# Altium project QUTMS_MCISO-V01.PrjPcb
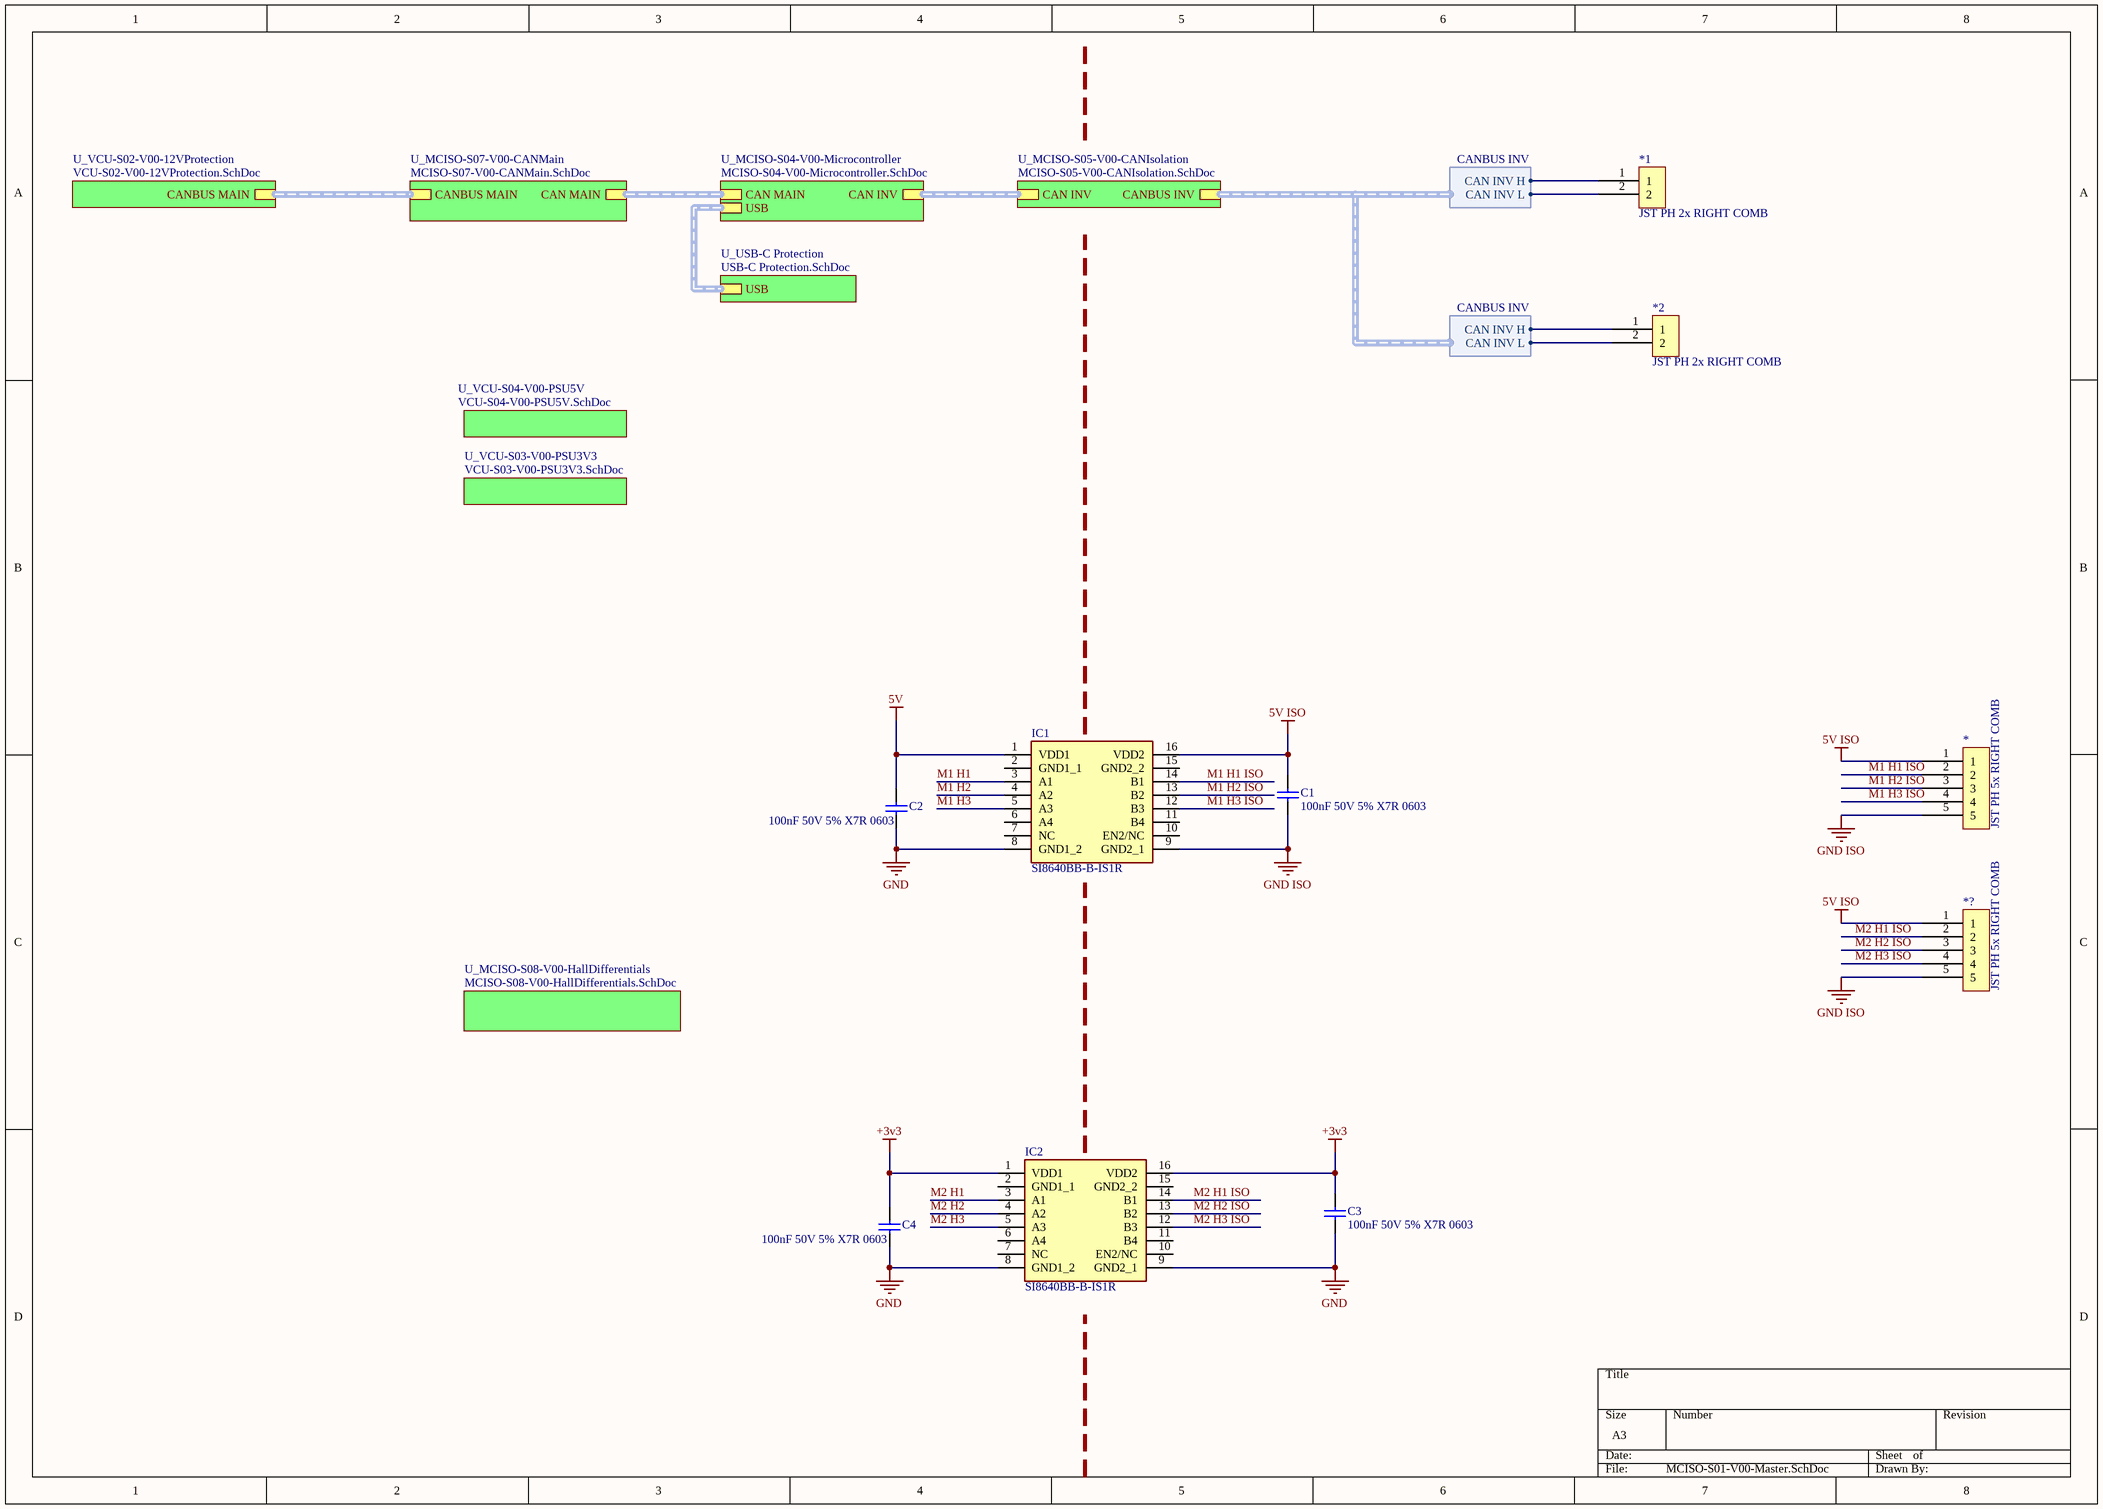
[diagram p0: MCISO-S01-V00-Master.SchDoc]
9 sheets, 120 parts. Net scope: hierarchical (ports join the sheet entries above them; power ports are global).
Board file: MCISO-P01-V00.PcbDoc
Sheets:
  MCISO-S01-V00-Master.SchDoc
    U_MCISO-S05-V00-CANIsolation = MCISO-S05-V00-CANIsolation.SchDoc
    U_MCISO-S04-V00-Microcontroller = MCISO-S04-V00-Microcontroller.SchDoc
    U_MCISO-S07-V00-CANMain = MCISO-S07-V00-CANMain.SchDoc
    U_VCU-S02-V00-12VProtection = VCU-S02-V00-12VProtection.SchDoc
    U_VCU-S03-V00-PSU3V3 = VCU-S03-V00-PSU3V3.SchDoc
    U_VCU-S04-V00-PSU5V = VCU-S04-V00-PSU5V.SchDoc
    U_MCISO-S08-V00-HallDifferentials = MCISO-S08-V00-HallDifferentials.SchDoc
    U_USB-C Protection = USB-C Protection.SchDoc

## Sheet MCISO-S01-V00-Master.SchDoc
size A3; SheetNumber: 1; SheetTotal: 9

### Parts
(Parts that share a designator on the sheet are numbered #1, #2 ... from top to bottom, then left to right.)
*1  JST PH 2x RIGHT COMB  [JST PH 2x RIGHT COMB]
*2  JST PH 2x RIGHT COMB  [JST PH 2x RIGHT COMB]
*#1  JST PH 5x RIGHT COMB  [JST PH 5x RIGHT COMB]
*?#1  JST PH 5x RIGHT COMB  [JST PH 5x RIGHT COMB]
C1  100nF 50V 5% X7R 0603  [Cap_Ceramic_0603]
C2  100nF 50V 5% X7R 0603  [Cap_Ceramic_0603]
C3  100nF 50V 5% X7R 0603  [Cap_Ceramic_0603]
C4  100nF 50V 5% X7R 0603  [Cap_Ceramic_0603]
IC1  SI8640BB-B-IS1R  [SOIC127P600X175-16N]
IC2  SI8640BB-B-IS1R  [SOIC127P600X175-16N]

### Sub-sheets
U_MCISO-S04-V00-Microcontroller = MCISO-S04-V00-Microcontroller.SchDoc: CAN MAIN (harness CAN MAIN), CAN INV (harness CAN INV), USB (harness *)
U_MCISO-S05-V00-CANIsolation = MCISO-S05-V00-CANIsolation.SchDoc: CAN INV (harness CAN), CANBUS INV (harness CANBUS INV)
U_MCISO-S07-V00-CANMain = MCISO-S07-V00-CANMain.SchDoc: CAN MAIN (harness CAN2), CANBUS MAIN (harness CANBUS2)
U_MCISO-S08-V00-HallDifferentials = MCISO-S08-V00-HallDifferentials.SchDoc: no entries
U_USB-C Protection = USB-C Protection.SchDoc: USB (harness *)
U_VCU-S02-V00-12VProtection = VCU-S02-V00-12VProtection.SchDoc: CANBUS MAIN (harness CANBUS MAIN)
U_VCU-S03-V00-PSU3V3 = VCU-S03-V00-PSU3V3.SchDoc: no entries
U_VCU-S04-V00-PSU5V = VCU-S04-V00-PSU5V.SchDoc: no entries

### Harnesses
CANBUS INV: CAN INV H, CAN INV L

### Nets
5V: C2.2 IC1.1(VDD1)
5V ISO: *#1.1 *?#1.1 C1.2 IC1.16(VDD2)
+3v3: C3.2 C4.2 IC2.1(VDD1) IC2.16(VDD2)
GND: C2.1 C3.1 C4.1 IC1.8(GND1_2) IC2.8(GND1_2) IC2.9(GND2_1)
GND ISO: *#1.5 *?#1.5 C1.1 IC1.9(GND2_1)
CAN H: *1.1 *2.1 ; sheet U_MCISO-S05-V00-CANIsolation/CANBUS INV.CAN INV H
CAN L: *1.2 *2.2 ; sheet U_MCISO-S05-V00-CANIsolation/CANBUS INV.CAN INV L
M1 H1: IC1.3(A1)
M1 H1 ISO: *#1.2 IC1.14(B1)
M1 H2: IC1.4(A2)
M1 H2 ISO: *#1.3 IC1.13(B2)
M1 H3: IC1.5(A3)
M1 H3 ISO: *#1.4 IC1.12(B3)
M2 H1: IC2.3(A1)
M2 H1 ISO: *?#1.2 IC2.14(B1)
M2 H2: IC2.4(A2)
M2 H2 ISO: *?#1.3 IC2.13(B2)
M2 H3: IC2.5(A3)
M2 H3 ISO: *?#1.4 IC2.12(B3)

Not connected (* = marked no-connect by the designer): IC1 2(GND1_1) 6(A4) 7(NC) 10(EN2/NC) 11(B4) 15(GND2_2); IC2 2(GND1_1) 6(A4) 7(NC) 10(EN2/NC) 11(B4) 15(GND2_2)

### Buses and harness runs
harness sheet U_MCISO-S04-V00-Microcontroller/CAN INV = sheet U_MCISO-S05-V00-CANIsolation/CAN INV
harness sheet U_MCISO-S04-V00-Microcontroller/CAN MAIN = sheet U_MCISO-S07-V00-CANMain/CAN MAIN
harness sheet U_MCISO-S04-V00-Microcontroller/USB = sheet U_USB-C Protection/USB
harness sheet U_MCISO-S07-V00-CANMain/CANBUS MAIN = sheet U_VCU-S02-V00-12VProtection/CANBUS MAIN

### Library data of the parts
C1-C4 = 100nF 50V 5% X7R 0603: Capacitor, Ceramic, SMD, 100nF, 50V, 5%, X7R, 0603
IC1 IC2 = SI8640BB-B-IS1R: Integrated Circuit; Manufacturer_Name: Silicon Labs; Datasheet Link: https://www.arrow.com/en/products/si8640bb-b-is1r/silicon-labs; Height: 1.75mm; Manufacturer_Part_Number: SI8640BB-B-IS1R; Mouser Part Number: 634-SI8640BB-B-IS1R; Mouser Price/Stock: https://www.mouser.co.uk/ProductDetail/Silicon-Labs/SI8640BB-B-IS1R?qs=j6MGy4L9yX09sv%252BEYaun9w%3D%3D; Arrow Part Number: SI8640BB-B-IS1R; Arrow Price/Stock: https://www.arrow.com/en/products/si8640bb-b-is1r/silicon-labs

## Sheet MCISO-S05-V00-CANIsolation.SchDoc: Isolated CANBUS @ 3V3
size A3; DrawnBy: Jonn Dillon; DocumentNumber: 4; Revision: 01; SheetNumber: 3; SheetTotal: 9; Version: 01; Project: Battery Managment System 2020; PageSetup: Record=PageOptions|CenterHorizontal=True|CenterVertical=True|PrintScale=0.97|XCorrection=1.00|YCorrection=1.00|PrintKind=0|BorderSize=5000000|LeftOffset=0|BottomOffset=0|Orientation=2|PaperLength=1000|PaperWidth=1000|Scale=100|PaperSource=7|PrintQuality=-4|MediaType=1|DitherType=10|PaperKind=A4|PrintScaleMode=1
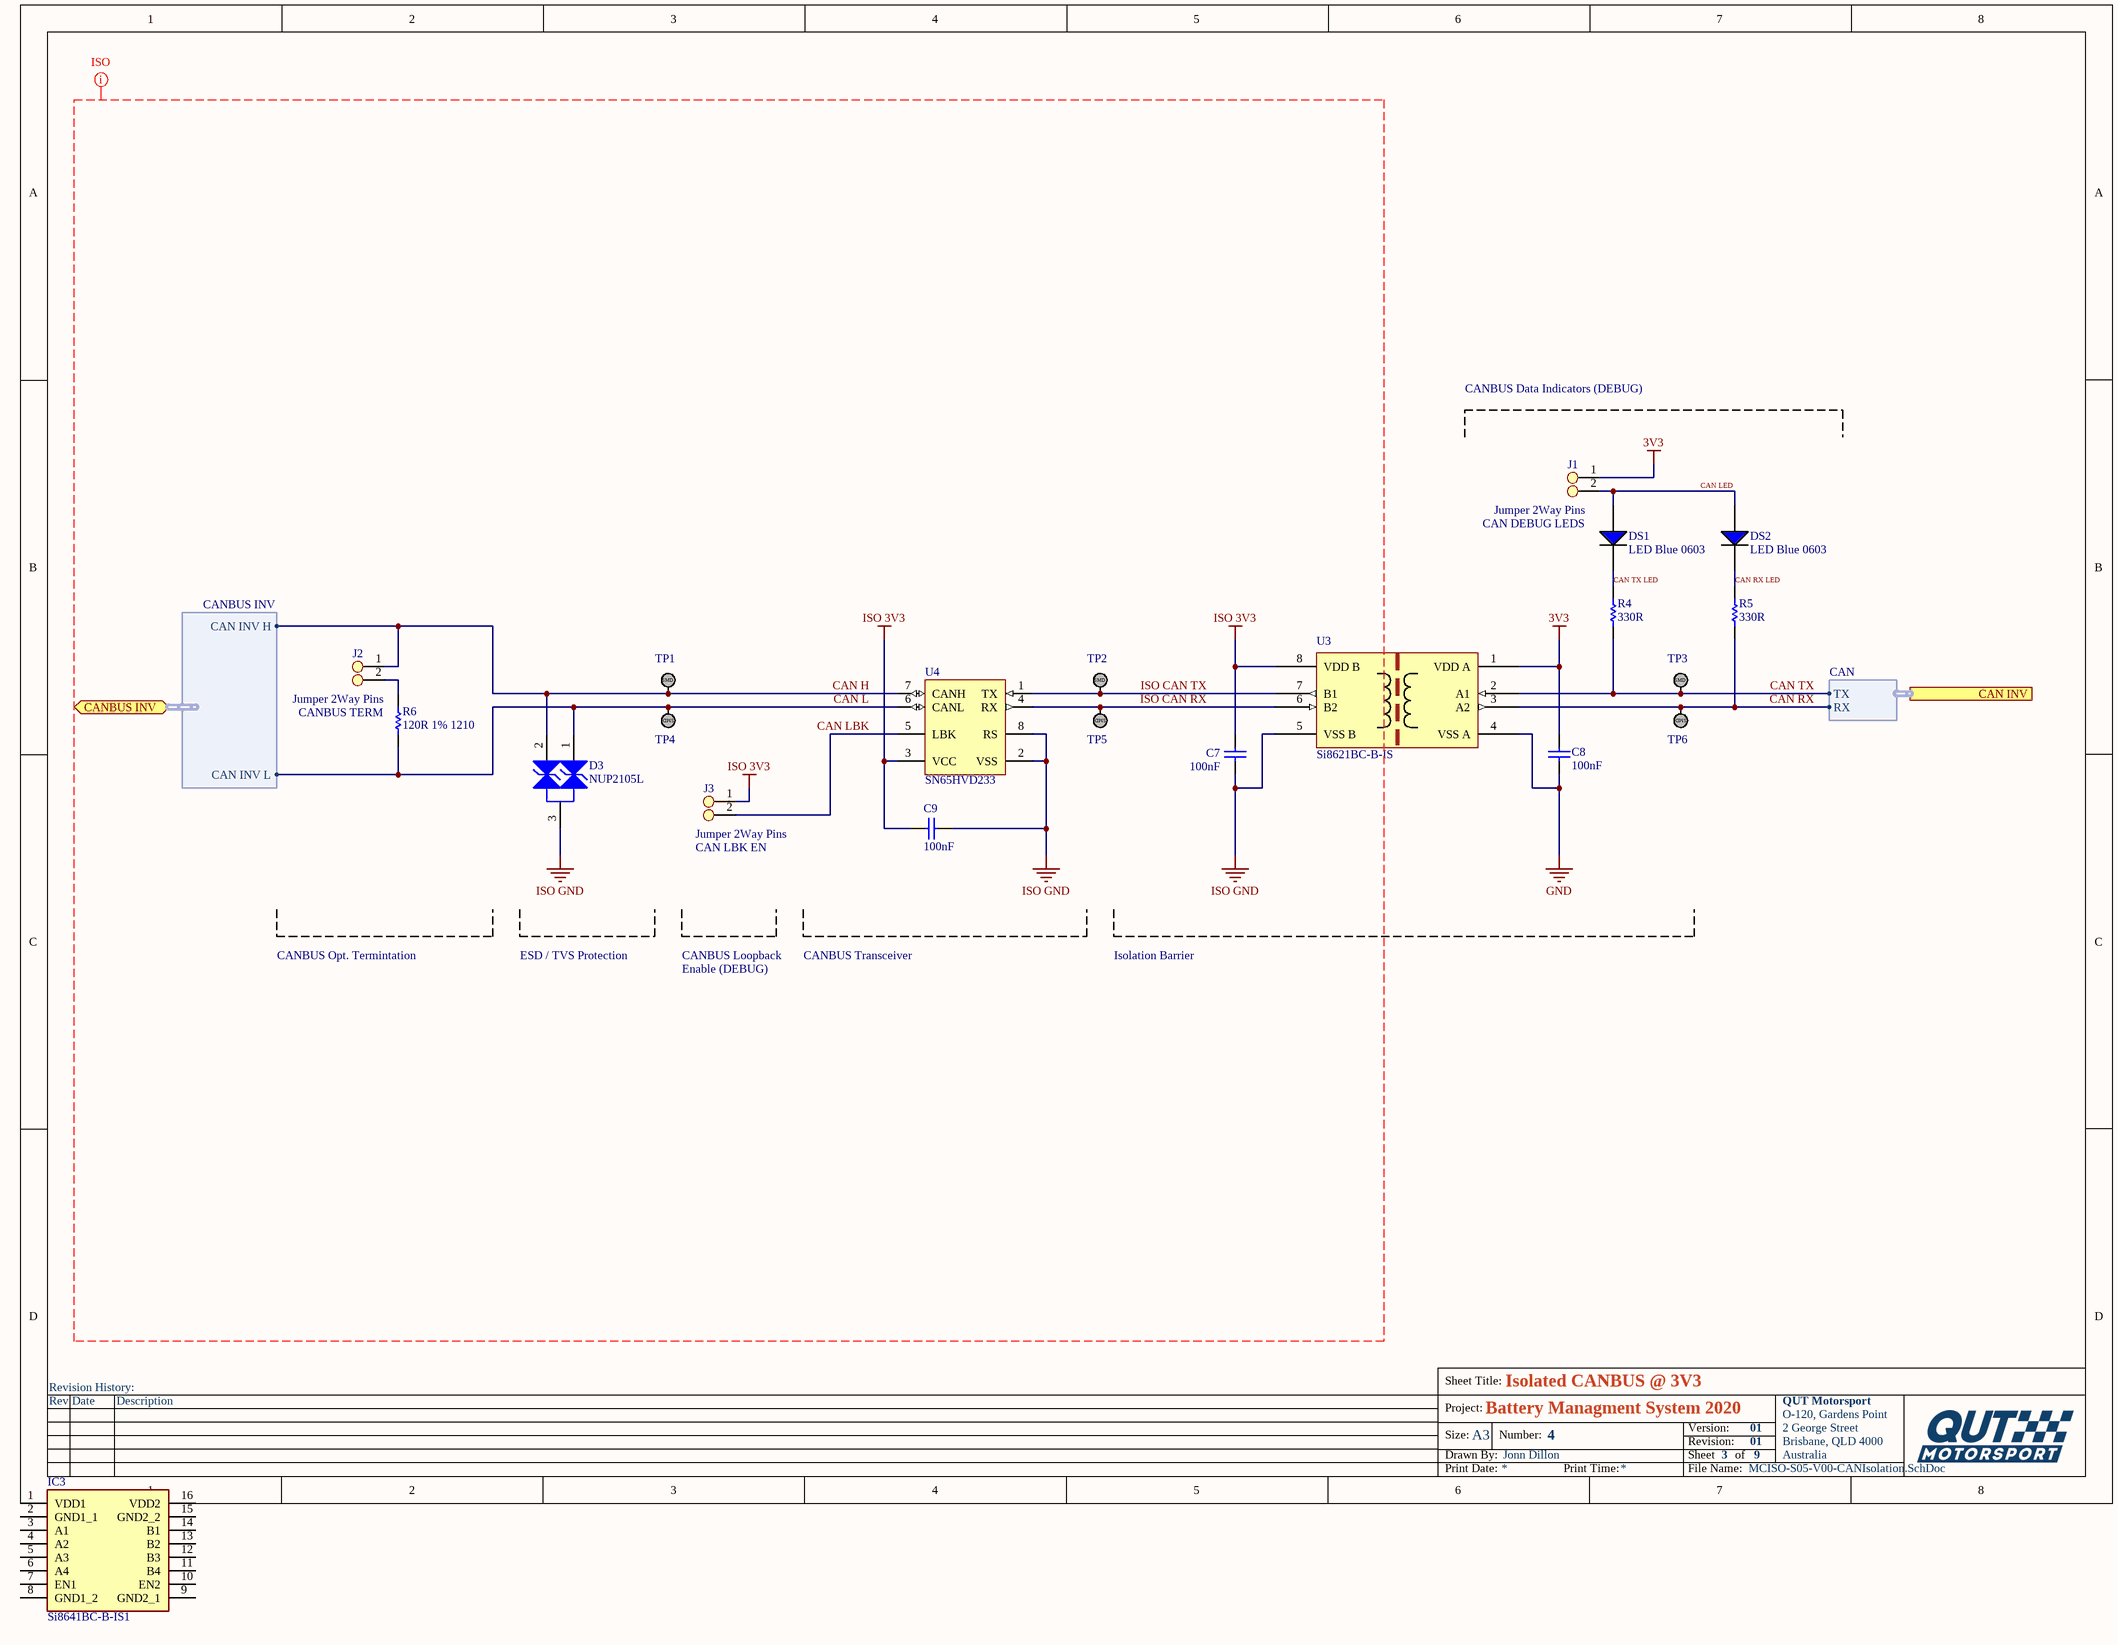
[diagram p1: MCISO-S05-V00-CANIsolation.SchDoc]

### Parts
C7  100nF  [Cap_Ceramic_0603]
C8  100nF  [Cap_Ceramic_0603]
C9  100nF  [Cap_Ceramic_0603]
D3  NUP2105L  [NUP2105L]
DS1  LED Blue 0603  [LED BLUE 0603]
DS2  LED Blue 0603  [LED BLUE 0603]
IC3  Si8641BC-B-IS1  [SOIC127P600X175-16N]
J1  Jumper 2Way Pins  [Jumper_2Way_Pin]
J2  Jumper 2Way Pins  [Jumper_2Way_Pin]
J3  Jumper 2Way Pins  [Jumper_2Way_Pin]
R4  330R  [Res_ThinFilm_0603]
R5  330R  [Res_ThinFilm_0603]
R6  120R 1% 1210  [Res_ThinFilm_1210]
TP1  TestPoint_SMD  [TestPointSMD]  (value not drawn)
TP2  TestPoint_SMD  [TestPointSMD]  (value not drawn)
TP3  TestPoint_SMD  [TestPointSMD]  (value not drawn)
TP4  TestPoint_SMD  [TestPointSMD]  (value not drawn)
TP5  TestPoint_SMD  [TestPointSMD]  (value not drawn)
TP6  TestPoint_SMD  [TestPointSMD]  (value not drawn)
U3  Si8621BC-B-IS  [Si8621BC-B-IS]
U4  SN65HVD233  [SN65HVD233DR]

### Ports
CAN INV (harness CAN), CANBUS INV (bidir, harness CANBUS INV)

### Harnesses
CANBUS INV: CAN INV H, CAN INV L
CAN: RX, TX

### Nets
3V3: C8.2 J1.1 U3.1(VDD_A)
GND: C8.1 U3.4(VSS_A)
ISO 3V3: C7.2 C9.2 J3.1 U3.8(VDD_B) U4.3(VCC)
ISO GND: C7.1 C9.1 D3.3 U3.5(VSS_B) U4.2(VSS) U4.8(RS)
CAN H: D3.2 J2.1 TP1.1 U4.7(CANH) ; port CANBUS INV.CAN INV H
CAN L: D3.1 R6.1 TP4.1 U4.6(CANL) ; port CANBUS INV.CAN INV L
CAN LBK: J3.2 U4.5(LBK)
CAN LED: DS1.1(A) DS2.1(A) J1.2
CAN RX: R5.1 TP6.1 U3.3(A2) ; port CAN INV.RX
CAN RX LED: DS2.2(C) R5.2
CAN TX: R4.1 TP3.1 U3.2(A1) ; port CAN INV.TX
CAN TX LED: DS1.2(C) R4.2
ISO CAN RX: TP5.1 U3.6(B2) U4.4(RX)
ISO CAN TX: TP2.1 U3.7(B1) U4.1(TX)
NetJ2_2: J2.2 R6.2

Not connected (* = marked no-connect by the designer): IC3 1(VDD1) 2(GND1_1) 3(A1) 4(A2) 5(A3) 6(A4) 7(EN1) 8(GND1_2) 9(GND2_1) 10(EN2) 11(B4) 12(B3) 13(B2) 14(B1) 15(GND2_2) 16(VDD2)

### Layout directives
mark named ISO: CAN H, CAN L, CAN LBK, ISO 3V3, ISO CAN RX, ISO CAN TX, ISO GND

### Notes on the sheet
- CANBUS Data Indicators (DEBUG)
- CAN DEBUG LEDS
- (near R6) CANBUS TERM
- (near J3) CAN LBK EN
- CANBUS Opt. Termintation
- ESD / TVS Protection
- CANBUS Loopback
- Enable (DEBUG)
- CANBUS Transceiver
- Isolation Barrier
- Revision History:
- Sheet Title:
- Rev
- Date
- Description
- Project:
- Size:
- Drawn By:
- A3
- Number:
- Revision:
- Sheet
- Version:
- of
- QUT Motorsport
- O-120, Gardens Point
- 2 George Street
- Brisbane, QLD 4000
- Australia
- Print Date:
- Print Time:
- File Name:
- (in symbol TestPoint_SMD) SMD

### Library data of the parts
C7-C9 = 100nF 50V 5% X7R 0603: as C1 on sheet MCISO-S01-V00-Master
IC3 = Si8641BC-B-IS1: Integrated Circuit; Manufacturer_Name: Silicon Labs; Datasheet Link: https://componentsearchengine.com/Datasheets/2/SI8641BC-B-IS1.pdf; Height: 1.75mm; Manufacturer_Part_Number: Si8641BC-B-IS1; Mouser Part Number: 634-SI8641BC-B-IS1; Mouser Price/Stock: https://www.mouser.co.uk/ProductDetail/Silicon-Labs/SI8641BC-B-IS1?qs=j6MGy4L9yX1Vde%2FgWgVbaA%3D%3D; Arrow Part Number: SI8641BC-B-IS1; Arrow Price/Stock: https://www.arrow.com/en/products/si8641bc-b-is1/silicon-labs
J1-J3 = Jumper 2Way Side Pins
R4 R5 = 330R 5% 0603: Resistor, SMD, 330R, 0.1W, 5%, 0603
R6 = 120R 1% 1210: Resistor, SMD, 120R, 0.25W, 1%, 1210
D3 = NUP2105L: ComponentLink1Description: Datasheet; ComponentLink1URL: https://www.onsemi.cn/PowerSolutions/document/NUP2105L-D.PDF; Parameter 1: *; ComponentLink2Description: LCSC; ComponentLink2URL: https://lcsc.com/product-detail/TVS_ON-Semiconductor-NUP2105LT1G_C14486.html; ComponentLink3Description: Digikey; ComponentLink3URL: https://www.digikey.com.au/product-detail/en/on-semiconductor/SZNUP2105LT1G/SZNUP2105LT1GOSCT-ND/3487669
U3 = Si8621BC-B-IS: ComponentLink1Description: Digikey; ComponentLink1URL: https://www.digikey.com.au/product-detail/en/silicon-labs/SI8621BC-B-ISR/336-4774-1-ND/8611005; ComponentLink2Description: Datasheet; ComponentLink2URL: https://www.silabs.com/documents/public/data-sheets/si861x-2x-datasheet.pdf
U4 = SN65HVD233: ComponentLink1Description: LCSC; ComponentLink1URL: https://lcsc.com/product-detail/CAN-ICs_Texas-Instruments_SN65HVD233DRG4_Texas-Instruments-Texas-Instruments-SN65HVD233DRG4_C61643.html; ComponentLink2Description: Digikey; ComponentLink2URL: https://www.digikey.com.au/product-detail/en/texas-instruments/SN65HVD233DR/296-35967-1-ND/4134960; ComponentLink3Description: Datasheet; ComponentLink3URL: https://www.ti.com/lit/ds/symlink/sn65hvd233.pdf?ts=1588560888178; ComponentLink4Description: Ti Product Page; ComponentLink4URL: https://www.ti.com/product/SN65HVD233

## Sheet MCISO-S04-V00-Microcontroller.SchDoc: AMU Microcontroller
size A3; DrawnBy: Thomas Benedetti; DocumentNumber: 4; Revision: 01; SheetNumber: 2; SheetTotal: 9; Version: 01; Project: AMU 2020; PageSetup: Record=PageOptions|CenterHorizontal=True|CenterVertical=True|PrintScale=0.97|XCorrection=1.00|YCorrection=1.00|PrintKind=0|BorderSize=5000000|LeftOffset=0|BottomOffset=0|Orientation=2|PaperLength=1000|PaperWidth=1000|Scale=100|PaperSource=7|PrintQuality=-4|MediaType=1|DitherType=10|PaperKind=A4|PrintScaleMode=1
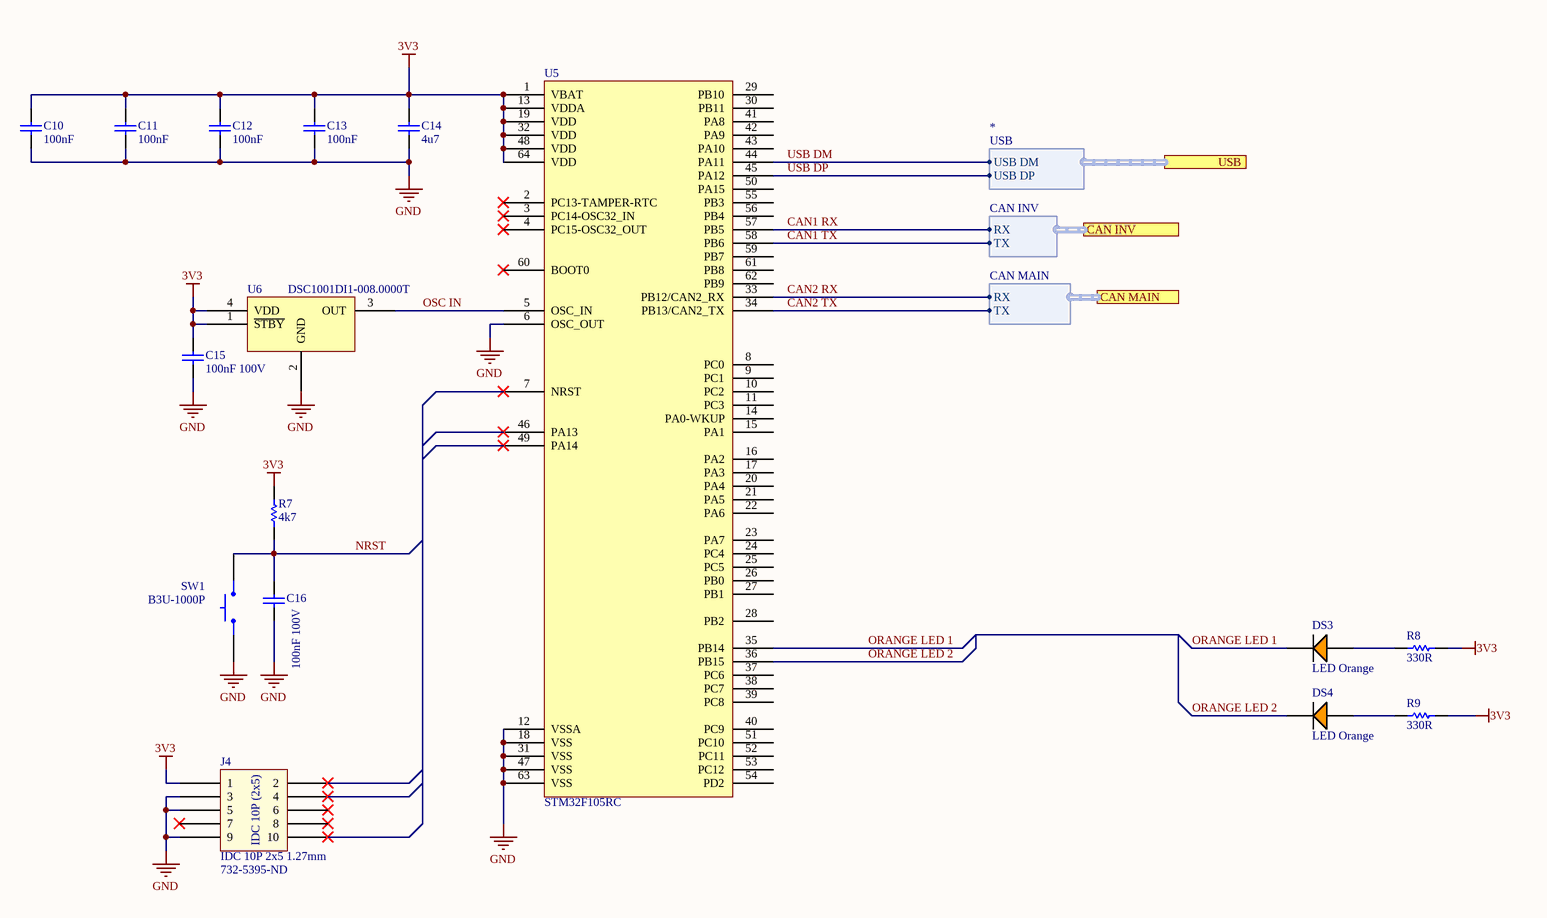
[diagram p2: MCISO-S04-V00-Microcontroller.SchDoc]

### Parts
(Parts that share a designator on the sheet are numbered #1, #2 ... from top to bottom, then left to right.)
C10  100nF  [Cap_Ceramic_0603]
C11  100nF  [Cap_Ceramic_0603]
C12  100nF  [Cap_Ceramic_0603]
C13  100nF  [Cap_Ceramic_0603]
C14  4u7  [Cap_Ceramic_0603]
C15  100nF 100V  [Cap_Ceramic_0603]
C16  100nF 100V  [Cap_Ceramic_0603]
DS3  LED Orange  [LED ORANGE 0603]
DS4  LED Orange  [LED ORANGE 0603]
J4  IDC 10P 2x5 1.27mm  [IDC 1.27MM 10P]
R7  4k7  [Res_ThinFilm_0603]
R8  330R  [Res_ThinFilm_0603]
R9  330R  [Res_ThinFilm_0603]
SW1  B3U-1000P  [BTN B3U-1000P]
U5  STM32F105RC  [STM32F105RC]
U6#1  DSC1001DI1-008.0000T  [DSC1001DI1-008.0000TCT-ND]

### Ports
CAN INV (harness CAN INV), CAN MAIN (harness CAN MAIN), USB (harness *)

### Harnesses
CAN MAIN: TX, RX
CAN INV: RX, TX
*: USB DM, USB DP

### Nets
3V3: C10.2 C11.2 C12.2 C13.2 C14.2 C15.2 J4.1 R7.2 R8.2 R9.2 U5.1(VBAT) U5.13(VDDA) U5.19(VDD) U5.32(VDD) U5.48(VDD) U5.64(VDD) U6#1.1(~{STBY}) U6#1.4(VDD)
GND: C10.1 C11.1 C12.1 C13.1 C14.1 C15.1 C16.1 J4.3 J4.5 J4.9 SW1.1 U5.6(OSC_OUT) U5.12(VSSA) U5.18(VSS) U5.31(VSS) U5.47(VSS) U5.63(VSS) U6#1.2(GND)
CAN1 RX: U5.57(PB5) ; port CAN INV.RX  [project net CAN RX]
CAN1 TX: U5.58(PB6) ; port CAN INV.TX  [project net CAN TX]
CAN2 RX: U5.33(PB12/CAN2_RX) ; port CAN MAIN.RX  [project net CAN MAIN RX]
CAN2 TX: U5.34(PB13/CAN2_TX) ; port CAN MAIN.TX  [project net CAN MAIN TX]
NRST: C16.2 R7.1 SW1.2
ORANGE LED 1: DS3.2(C) U5.35(PB14)
ORANGE LED 2: DS4.2(C) U5.36(PB15)
OSC IN: U5.5(OSC_IN) U6#1.3(OUT)
USB DM: U5.44(PA11) ; port USB.USB DM
USB DP: U5.45(PA12) ; port USB.USB DP
NetDS3_1: DS3.1(A) R8.1
NetDS4_1: DS4.1(A) R9.1

Not connected (* = marked no-connect by the designer): J4 2* 4* 6* 7* 8* 10*; U5 2(PC13-TAMPER-RTC)* 3(PC14-OSC32_IN)* 4(PC15-OSC32_OUT)* 7(NRST)* 8(PC0) 9(PC1) 10(PC2) 11(PC3) 14(PA0-WKUP) 15(PA1) 16(PA2) 17(PA3) 20(PA4) 21(PA5) 22(PA6) 23(PA7) 24(PC4) 25(PC5) 26(PB0) 27(PB1) 28(PB2) 29(PB10) 30(PB11) 37(PC6) 38(PC7) 39(PC8) 40(PC9) 41(PA8) 42(PA9) 43(PA10) 46(PA13)* 49(PA14)* 50(PA15) 51(PC10) 52(PC11) 53(PC12) 54(PD2) 55(PB3) 56(PB4) 59(PB7) 60(BOOT0)* 61(PB8) 62(PB9)

### Notes on the sheet
- USB
- (near J4) 732-5395-ND
- Revision History:
- Sheet Title:
- Rev
- Date
- Description
- Project:
- Size:
- Drawn By:
- A3
- Number:
- Revision:
- Sheet
- Version:
- of
- QUT Motorsport
- O-120, Gardens Point
- 2 George Street
- Brisbane, QLD 4000
- Australia
- Print Date:
- Print Time:
- File Name:
- (in symbol IDC 10P 2x5 1.27mm) IDC 10P (2x5)

### Library data of the parts
C10-C13 = 100nF 50V 5% X7R 0603: as C1 on sheet MCISO-S01-V00-Master
C14 = 4u7 50V 5% X7R 0603: Capacitor, Ceramic, SMD, 4u7, 50V, 5%, X7R, 0603
C15 C16 = 100nF 100V 5% X7R 0603: Capacitor, Ceramic, SMD, 100nF, 100V, 5%, X7R, 0603
DS3 DS4 = LED ORANGE 0603
R7 = 4k7 5% 0603: Resistor, SMD, 4k7, 0.1W, 5%, 0603
R8 R9 = 330R 5% 0603: Resistor, SMD, 330R, 0.1W, 5%, 0603
SW1 = BTN B3U-1000P: Omron B3U-1000P Ultra Miniture Switch; ComponentLink1Description: LCSC; ComponentLink1URL: https://lcsc.com/product-detail/Tactile-Switches_BRIGHT-TSA063G50-250_C294565.html
U5 = STM32F105RC: ARM® Cortex®-M3 STM32F1 Microcontroller IC 32-Bit 72MHz 256KB (256K x 8) FLASH 64-LQFP (10x10); ComponentLink1Description: Digikey; ComponentLink1URL: https://www.digikey.com.au/product-detail/en/stmicroelectronics/STM32F105RCT6TR/497-17397-1-ND/8024118; ComponentLink2Description: Datasheet; ComponentLink2URL: https://www.st.com/content/ccc/resource/technical/document/datasheet/e4/f3/1a/89/5a/02/46/ae/CD00220364.pdf/files/CD00220364.pdf/jcr:content/translations/en.CD00220364.pdf
U6#1 = DSC1001DI1-008.0000T: on 8MHz XO (Standard) CMOS Oscillator 1.8 ~ 3.3V Standby (Power Down) 4-SMD, No Lead

## Sheet MCISO-S07-V00-CANMain.SchDoc: Isolated CANBUS2 3V3
size A3; DrawnBy: Jonn Dillon; DocumentNumber: 5; Revision: 01; SheetNumber: 4; SheetTotal: 9; Version: 01; Project: AMU 2020 (Sourced from BMS 2020); PageSetup: Record=PageOptions|CenterHorizontal=True|CenterVertical=True|PrintScale=0.97|XCorrection=1.00|YCorrection=1.00|PrintKind=0|BorderSize=5000000|LeftOffset=0|BottomOffset=0|Orientation=2|PaperLength=1000|PaperWidth=1000|Scale=100|PaperSource=7|PrintQuality=-4|MediaType=1|DitherType=10|PaperKind=A4|PrintScaleMode=1
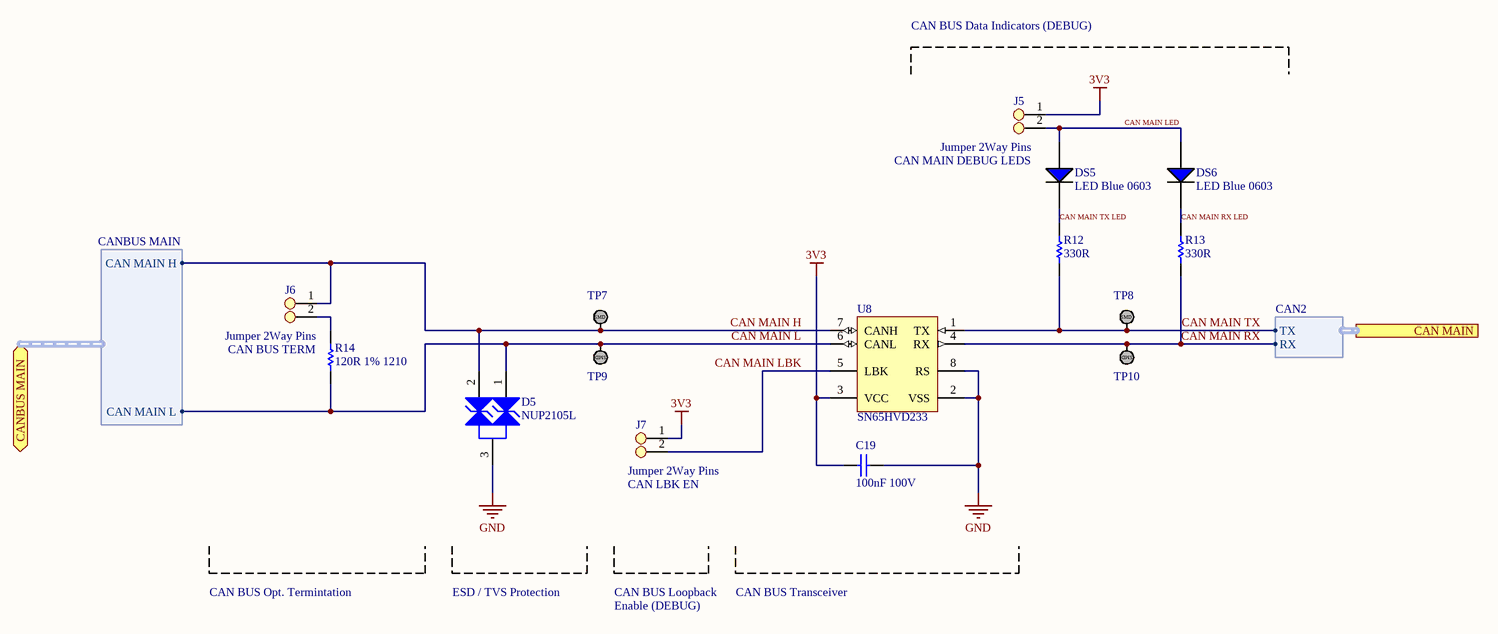
[diagram p3: MCISO-S07-V00-CANMain.SchDoc]

### Parts
C19  100nF 100V  [Cap_Ceramic_0603]
D5  NUP2105L  [NUP2105L]
DS5  LED Blue 0603  [LED BLUE 0603]
DS6  LED Blue 0603  [LED BLUE 0603]
J5  Jumper 2Way Pins  [Jumper_2Way_Pin]
J6  Jumper 2Way Pins  [Jumper_2Way_Pin]
J7  Jumper 2Way Pins  [Jumper_2Way_Pin]
R12  330R  [Res_ThinFilm_0603]
R13  330R  [Res_ThinFilm_0603]
R14  120R 1% 1210  [Res_ThinFilm_1210]
TP7  TestPoint_SMD  [TestPointSMD]  (value not drawn)
TP8  TestPoint_SMD  [TestPointSMD]  (value not drawn)
TP9  TestPoint_SMD  [TestPointSMD]  (value not drawn)
TP10  TestPoint_SMD  [TestPointSMD]  (value not drawn)
U8  SN65HVD233  [SN65HVD233DR]

### Ports
CAN MAIN (harness CAN2), CANBUS MAIN (bidir, harness CANBUS MAIN)

### Harnesses
CANBUS MAIN: CAN MAIN H, CAN MAIN L
CAN2: RX, TX

### Nets
3V3: C19.2 J5.1 J7.1 U8.3(VCC)
GND: C19.1 D5.3 U8.2(VSS) U8.8(RS)
CAN MAIN H: D5.2 J6.1 TP7.1 U8.7(CANH) ; port CANBUS MAIN.CAN MAIN H
CAN MAIN L: D5.1 R14.1 TP9.1 U8.6(CANL) ; port CANBUS MAIN.CAN MAIN L
CAN MAIN LBK: J7.2 U8.5(LBK)
CAN MAIN LED: DS5.1(A) DS6.1(A) J5.2
CAN MAIN RX: R13.1 TP10.1 U8.4(RX) ; port CAN MAIN.RX
CAN MAIN RX LED: DS6.2(C) R13.2
CAN MAIN TX: R12.1 TP8.1 U8.1(TX) ; port CAN MAIN.TX
CAN MAIN TX LED: DS5.2(C) R12.2
NetJ6_2: J6.2 R14.2

### Notes on the sheet
- CAN BUS Data Indicators (DEBUG)
- CAN MAIN DEBUG LEDS
- (near R14) CAN BUS TERM
- (near J7) CAN LBK EN
- CAN BUS Opt. Termintation
- ESD / TVS Protection
- CAN BUS Loopback
- Enable (DEBUG)
- CAN BUS Transceiver
- Revision History:
- Sheet Title:
- Rev
- Date
- Description
- Project:
- Size:
- Drawn By:
- A3
- Number:
- Revision:
- Sheet
- Version:
- of
- QUT Motorsport
- O-120, Gardens Point
- 2 George Street
- Brisbane, QLD 4000
- Australia
- Print Date:
- Print Time:
- File Name:
- (in symbol TestPoint_SMD) SMD

### Library data of the parts
C19 = 100nF 100V 5% X7R 0603: as C15 on sheet MCISO-S04-V00-Microcontroller
J5-J7 = Jumper 2Way Side Pins
R12 R13 = 330R 5% 0603: Resistor, SMD, 330R, 0.1W, 5%, 0603
R14 = 120R 1% 1210: Resistor, SMD, 120R, 0.25W, 1%, 1210
D5 = NUP2105L: ComponentLink1Description: Datasheet; ComponentLink1URL: https://www.onsemi.cn/PowerSolutions/document/NUP2105L-D.PDF; Parameter 1: *; ComponentLink2Description: LCSC; ComponentLink2URL: https://lcsc.com/product-detail/TVS_ON-Semiconductor-NUP2105LT1G_C14486.html; ComponentLink3Description: Digikey; ComponentLink3URL: https://www.digikey.com.au/product-detail/en/on-semiconductor/SZNUP2105LT1G/SZNUP2105LT1GOSCT-ND/3487669
U8 = SN65HVD233: ComponentLink1Description: LCSC; ComponentLink1URL: https://lcsc.com/product-detail/CAN-ICs_Texas-Instruments_SN65HVD233DRG4_Texas-Instruments-Texas-Instruments-SN65HVD233DRG4_C61643.html; ComponentLink2Description: Digikey; ComponentLink2URL: https://www.digikey.com.au/product-detail/en/texas-instruments/SN65HVD233DR/296-35967-1-ND/4134960; ComponentLink3Description: Datasheet; ComponentLink3URL: https://www.ti.com/lit/ds/symlink/sn65hvd233.pdf?ts=1588560888178; ComponentLink4Description: Ti Product Page; ComponentLink4URL: https://www.ti.com/product/SN65HVD233

## Sheet VCU-S02-V00-12VProtection.SchDoc
size A4; SheetNumber: 6; SheetTotal: 9
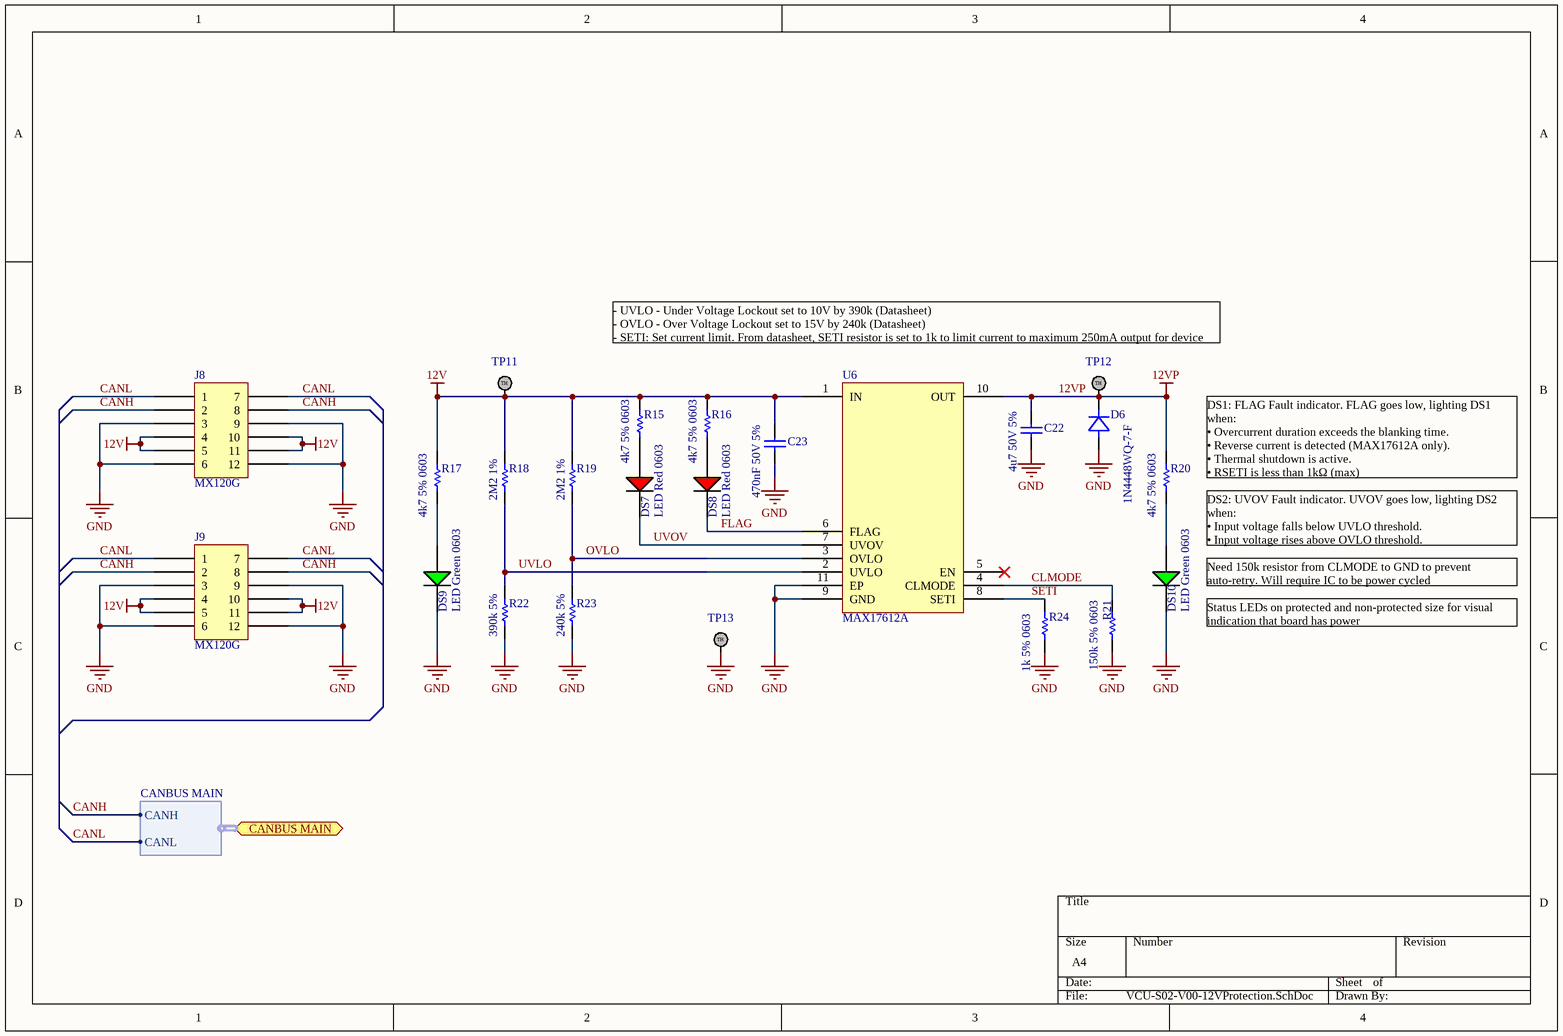
[diagram p4: VCU-S02-V00-12VProtection.SchDoc]

### Parts
(Parts that share a designator on the sheet are numbered #1, #2 ... from top to bottom, then left to right.)
C22  4u7 50V 5%  [Cap_Ceramic_0603]
C23  470nF 50V 5%  [Cap_Ceramic_0603]
D6  1N4448WQ-7-F  [SMA]
DS7  LED Red 0603  [LED RED 0603]
DS8  LED Red 0603  [LED RED 0603]
DS9  LED Green 0603  [LED GREEN 0603]
DS10  LED Green 0603  [LED GREEN 0603]
J8  MX120G  [MX120G]
J9  MX120G  [MX120G]
R15  4k7 5% 0603  [Res_ThinFilm_0603]
R16  4k7 5% 0603  [Res_ThinFilm_0603]
R17  4k7 5% 0603  [Res_ThinFilm_0603]
R18  2M2 1%  [Res_ThinFilm_0603]
R19  2M2 1%  [Res_ThinFilm_0603]
R20  4k7 5% 0603  [Res_ThinFilm_0603]
R21  150k 5% 0603  [Res_ThinFilm_0603]
R22  390k 5%  [Res_ThinFilm_0603]
R23  240k 5%  [Res_ThinFilm_0603]
R24  1k 5% 0603  [Res_ThinFilm_0603]
TP11  TestPoint  [TestPoint]  (value not drawn)
TP12  TestPoint  [TestPoint]  (value not drawn)
TP13  TestPoint  [TestPoint]  (value not drawn)
U6#2  MAX17612A  [10-Pin TDFN EP]

### Ports
CANBUS MAIN (bidir, harness CANBUS MAIN)

### Harnesses
CANBUS MAIN: CANH, CANL

### Nets
12V: C23.2 J8.4 J8.5 J8.10 J8.11 J9.4 J9.5 J9.10 J9.11 R15.2 R16.2 R17.2 R18.2 R19.2 TP11.1 U6#2.1(IN)
12VP: C22.2 D6.K(Cathode) R20.2 TP12.1 U6#2.10(OUT)
GND: C22.1 C23.1 D6.A(Anode) DS9.2(C) DS10.2(C) J8.3 J8.6 J8.9 J8.12 J9.3 J9.6 J9.9 J9.12 R21.1 R22.1 R23.1 R24.1 TP13.1 U6#2.9(GND) U6#2.11(EP)
CANH: J8.2 J8.8 J9.2 J9.8 ; port CANBUS MAIN.CANH
CANL: J8.1 J8.7 J9.1 J9.7 ; port CANBUS MAIN.CANL
CLMODE: R21.2 U6#2.4(CLMODE)
FLAG: DS8.2(C) U6#2.6(FLAG)
OVLO: R19.1 R23.2 U6#2.3(OVLO)
SETI: R24.2 U6#2.8(SETI)
UVLO: R18.1 R22.2 U6#2.2(UVLO)
UVOV: DS7.2(C) U6#2.7(UVOV)
NetDS7_1: DS7.1(A) R15.1
NetDS8_1: DS8.1(A) R16.1
NetDS9_1: DS9.1(A) R17.1
NetDS10_1: DS10.1(A) R20.1

Not connected (* = marked no-connect by the designer): U6#2 5(EN)*

### Notes on the sheet
- - UVLO - Under Voltage Lockout set to 10V by 390k (Datasheet)
  - OVLO - Over Voltage Lockout set to 15V by 240k (Datasheet)
  - SETI: Set current limit. From datasheet, SETI resistor is set to 1k to limit current to maximum 250mA output for device
- (near R20) DS1: FLAG Fault indicator. FLAG goes low, lighting DS1 when:
  • Overcurrent duration exceeds the blanking time.
  • Reverse current is detected (MAX17612A only).
  • Thermal shutdown is active.
  • RSETI is less than 1kΩ (max)
- DS2: UVOV Fault indicator. UVOV goes low, lighting DS2 when:
  • Input voltage falls below UVLO threshold.
  • Input voltage rises above OVLO threshold.
- (near DS10) Need 150k resistor from CLMODE to GND to prevent auto-retry. Will require IC to be power cycled
- (near DS10) Status LEDs on protected and non-protected size for visual indication that board has power
- (in symbol TestPoint) TH

### Library data of the parts
C22 = 4u7 50V 5% X7R 0603: as C14 on sheet MCISO-S04-V00-Microcontroller
C23 = 470nF 50V 5% X7R 0603: Capacitor, Ceramic, SMD, 470nF, 50V, 5%, X7R, 0603
D6 = 1N4448WQ-7-F: Diode, SMD, 75V, 5%, 250mA, SOD123; Manufacturer: ON Semiconductor / Fairchild; Manufacturer Part Number: 1N914BWS; Average Rectified Current: 150mA; Element Configuration: Single; Forward Voltage: 1V; Max Reverse Leakage Current: 5uA; Power Dissipation: 200mW; Recovery Time: 4ns; Max Forward Surge Current (Ifsm): 4A; Parameter 1: *; Weight: 0.0276g; Category: Rectifier Diodes; Contact Plating: Tin,Matte; Forward Current: 150mA; Lead Free: Lead Free; Max Operating Temperature: 150°C; Max Repetitive Reverse Voltage (Vrrm): 75V; Max Reverse Voltage (DC): 75V; Min Operating Temperature: -55°C; Mount: Surface Mount; Number of Pins: 2; Package Quantity: 1; Packaging: Tape and Reel; Peak Reverse Current: 5uA; Radiation Hardening: No; REACH SVHC: No SVHC; Reverse Recovery Time: 4ns; Height: 1mm; Length: 1.8mm; Reverse Voltage: 75V; Width: 1.35mm
J8 J9 = MX120G: MX120G with standard connector layout
R15-R17 R20 = 4k7 5% 0603: Resistor, SMD, 4k7, 0.1W, 5%, 0603
R18 R19 = 2M2 1% 0603: Resistor, SMD, 2M2, 0.125W, 1%, 0603
R21 = 150k 5%, 0603: Resistor, SMD, 150k, 0.1W, 5%, 0603
R22 = 390k 5% 0603: Resistor, SMD, 390k, 0.1W, 5%, 0603
R23 = 240k 5% 0603: Resistor, SMD, 240k, 0.1W, 5%, 0603
R24 = 1k 5% 0603: Resistor, SMD, 1k, 0.1W, 5%, 0603
U6#2 = MAX17612A: 4.5V to 60V, 250mA Current-Limiter with OV, UV, and Reverse Protection; ComponentLink1Description: Datasheet; ComponentLink1URL: https://datasheets.maximintegrated.com/en/ds/MAX17612A-MAX17612C.pdf

## Sheet VCU-S03-V00-PSU3V3.SchDoc: Power Supply (20-40V to 3v3 @ 0.1-0.6A)
size A3; DrawnBy: Jonn Dillon; DocumentNumber: 2; Revision: 01; SheetNumber: 7; SheetTotal: 9; Version: 01; Project: AMU 2020 (Sourced from BMS 2020); PageSetup: Record=PageOptions|CenterHorizontal=True|CenterVertical=True|PrintScale=0.97|XCorrection=1.00|YCorrection=1.00|PrintKind=0|BorderSize=5000000|LeftOffset=0|BottomOffset=0|Orientation=2|PaperLength=1000|PaperWidth=1000|Scale=100|PaperSource=7|PrintQuality=-4|MediaType=1|DitherType=10|PaperKind=A4|PrintScaleMode=1
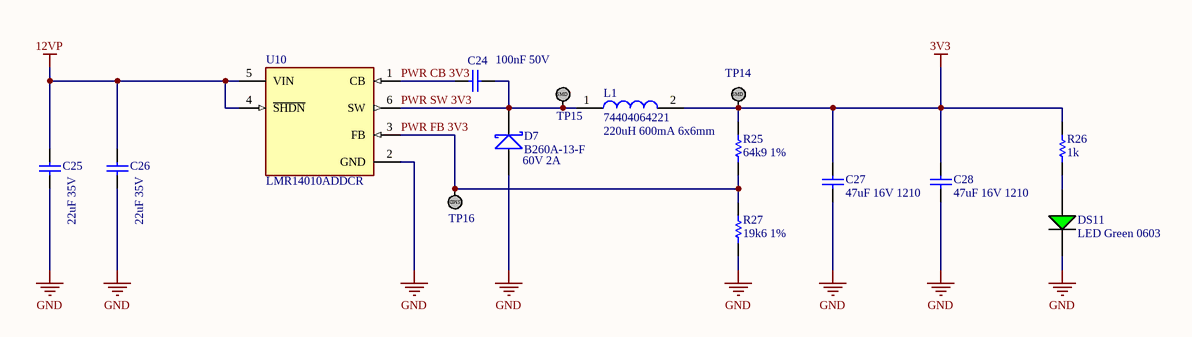
[diagram p5: VCU-S03-V00-PSU3V3.SchDoc]

### Parts
C24  100nF 50V  [Cap_Ceramic_0603]
C25  22uF 35V  [Cap_Ceramic_1206]
C26  22uF 35V  [Cap_Ceramic_1206]
C27  47uF 16V 1210  [Cap_Ceramic_1210]
C28  47uF 16V 1210  [Cap_Ceramic_1210]
D7  B260A-13-F  [SMA]
DS11  LED Green 0603  [LED GREEN 0603]
L1  74404064221  [Inductor_6x6mm]
R25  64k9 1%  [Res_ThinFilm_0603]
R26  1k  [Res_ThinFilm_0603]
R27  19k6 1%  [Res_ThinFilm_0603]
TP14  TestPoint_SMD  [TestPointSMD]  (value not drawn)
TP15  TestPoint_SMD  [TestPointSMD]  (value not drawn)
TP16  TestPoint_SMD  [TestPointSMD]  (value not drawn)
U10  LMR14010ADDCR  [FP-DDC0006A-MFG]

### Nets
3V3: C27.2 C28.2 L1.2 R25.2 R26.2 TP14.1
12VP: C25.2 C26.2 U10.4(~{SHDN}) U10.5(VIN)
GND: C25.1 C26.1 C27.1 C28.1 D7.A DS11.2(C) R27.1 U10.2(GND)
PWR CB 3V3: C24.1 U10.1(CB)
PWR FB 3V3: R25.1 R27.2 TP16.1 U10.3(FB)
PWR SW 3V3: C24.2 D7.K L1.1 TP15.1 U10.6(SW)
NetDS11_1: DS11.1(A) R26.1

### Notes on the sheet
- (near D7) 60V 2A
- (near L1) 220uH 600mA 6x6mm
- Title
- Size:
- Date:
- A3
- Number:
- Time:
- Revision:
- Sheet
- of
- File:
- (in symbol TestPoint_SMD) SMD

### Library data of the parts
C24 = 100nF 50V 5% X7R 0603: as C1 on sheet MCISO-S01-V00-Master
C25 C26 = 22uF 35V 20% X5R 1206: 22µF ±20% 35V Ceramic Capacitor X5R 1206 (3216 Metric); ComponentLink1Description: Digikey; ComponentLink1URL: https://www.digikey.com.au/product-detail/en/tdk-corporation/C3216X5R1V226M160AC/445-8045-1-ND/2792165; ComponentLink2Description: Datasheet; ComponentLink2URL: https://product.tdk.com/info/en/catalog/datasheets/mlcc_commercial_general_en.pdf
C27 C28 = 47uF 16V 10% X7R 1210: Capacitor, Ceramic, SMD, 47uF, 16V, 5%, X7R, 1210
D7 = B260A-13-F: Diode, Schottky Barrier Rectifier, 60 V, 2 A, B260A-13-F
L1 = 74404064221: FIXED IND 220UH 660MA 850 MOHM; ComponentLink1Description: Digikey; ComponentLink1URL: https://www.digikey.com.au/product-detail/en/w%C3%BCrth-elektronik/74404064221/732-7261-1-ND/5353241; ComponentLink2Description: LCSC A; ComponentLink2URL: https://lcsc.com/product-detail/Power-Inductors_Sunlord-SWPA6045S221MT_C91047.html; ComponentLink3Description: LCSC B; ComponentLink3URL: https://lcsc.com/product-detail/Power-Inductors_SXN-Shun-Xiang-Nuo-Elec-SMNR6045-221MT_C467145.html
R25 = 64k9 1% 0603: Resistor, SMD, 64k9, 0.1W, 5%, 0603
R26 = 1k 5% 0603: Resistor, SMD, 1k, 0.1W, 5%, 0603
R27 = 19k6 1% 0603: Resistor, SMD, 19k6, 0.1W, 5%, 0603
U10 = CMP-04918-000056-1: IC REG BUCK ADJ 1A TSOT23-6; Manufacturer: Texas Instruments; Max Junction Temp: +125°C; Number Of Outputs: 1; Standoff Height: 0mm; Switching Frequency: 700kHz; Min Supply Voltage: 4V; Max Supply Voltage: 40V; Max Duty Cycle: 96%; Output Type: AdjustableProgrammable; Manufacturer Part Number: LMR14010ADDCR; Temperature: -40°C to +125°C; Output Current: 1A; Category: IC; Temperature Range High: +125°C; Lead Free: Yes; Switching Topology: Buck; Mouser Description: 4-V to 40-V, 1-A Step-Down Converter With High Efficiency Eco-Mode 6-SOT-23-THIN -40 to 125; Device Class L1: Integrated Circuits (ICs); Digikey Description: IC REG BUCK ADJ 1A TSOT23-6; Package: DDC0006A; Ipc Land Pattern Name: SOT95P280X110-6; Device Class L2: Power Management ICs; Temperature Range Low: -40°C; Height: 1.1mm; Device Class L3: Voltage Regulators - Switching; RoHS: TRUE; Automotive: No; Octopart: https://octopart.com/lmr14010addcr-texas+instruments-90753290; ComponentLink2URL: https://www.ti.com/lit/ds/symlink/lmr14010a.pdf; ComponentLink2Description: Datasheet

## Sheet VCU-S04-V00-PSU5V.SchDoc: Power Supply (9-25V to 5V @ 0.1-0.3A)
size A3; DrawnBy: Jonn Dillon; DocumentNumber: 11; Revision: 01; SheetNumber: 8; SheetTotal: 9; Version: 01; Project: Chassis Controller (Interim) 2020; PageSetup: Record=PageOptions|CenterHorizontal=True|CenterVertical=True|PrintScale=0.97|XCorrection=1.00|YCorrection=1.00|PrintKind=0|BorderSize=5000000|LeftOffset=0|BottomOffset=0|Orientation=2|PaperLength=1000|PaperWidth=1000|Scale=100|PaperSource=7|PrintQuality=-4|MediaType=1|DitherType=10|PaperKind=A4|PrintScaleMode=1
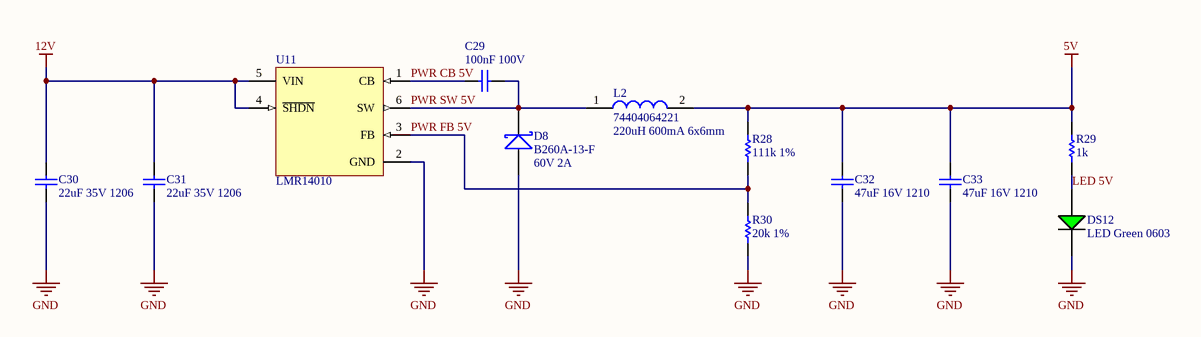
[diagram p6: VCU-S04-V00-PSU5V.SchDoc]

### Parts
C29  100nF 100V  [Cap_Ceramic_0603]
C30  22uF 35V 1206  [Cap_Ceramic_1206]
C31  22uF 35V 1206  [Cap_Ceramic_1206]
C32  47uF 16V 1210  [Cap_Ceramic_1210]
C33  47uF 16V 1210  [Cap_Ceramic_1210]
D8  B260A-13-F  [SMA]
DS12  LED Green 0603  [LED GREEN 0603]
L2  74404064221  [Inductor_6x6mm]
R28  111k 1%  [Res_ThinFilm_0603]
R29  1k  [Res_ThinFilm_0603]
R30  20k 1%  [Res_ThinFilm_0603]
U11  LMR14010  [LMR14010]

### Nets
5V: C32.2 C33.2 L2.2 R28.2 R29.2
12V: C30.2 C31.2 U11.4(~{SHDN}) U11.5(VIN)
GND: C30.1 C31.1 C32.1 C33.1 D8.A DS12.2(C) R30.1 U11.2(GND)
LED 5V: DS12.1(A) R29.1
PWR CB 5V: C29.1 U11.1(CB)
PWR FB 5V: R28.1 R30.2 U11.3(FB)
PWR SW 5V: C29.2 D8.K L2.1 U11.6(SW)

### Notes on the sheet
- (near L2) 220uH 600mA 6x6mm
- (near D8) 60V 2A
- Title
- Size:
- Date:
- A3
- Number:
- Time:
- Revision:
- Sheet
- of
- File:

### Library data of the parts
C29 = 100nF 100V 5% X7R 0603: as C15 on sheet MCISO-S04-V00-Microcontroller
C30 C31 = 22uF 35V 10% X7R 1206: Capacitor, Ceramic, SMD, 22uF, 35V, 10%, X7R, 1206
C32 C33 = 47uF 16V 10% X7R 1210: as C27 on sheet VCU-S03-V00-PSU3V3
D8 = B260A-13-F: as D7 on sheet VCU-S03-V00-PSU3V3
L2 = 74404064221: FIXED IND 220UH 660MA 850 MOHM; ComponentLink1Description: Digikey; ComponentLink1URL: https://www.digikey.com.au/product-detail/en/w%C3%BCrth-elektronik/74404064221/732-7261-1-ND/5353241; ComponentLink2Description: LCSC A; ComponentLink2URL: https://lcsc.com/product-detail/Power-Inductors_Sunlord-SWPA6045S221MT_C91047.html; ComponentLink3Description: LCSC B; ComponentLink3URL: https://lcsc.com/product-detail/Power-Inductors_SXN-Shun-Xiang-Nuo-Elec-SMNR6045-221MT_C467145.html
R28 = 111k 1% 0603: Resistor, SMD, 111k, 0.1W, 5%, 0603
R29 = 1k 5% 0603: Resistor, SMD, 1k, 0.1W, 5%, 0603
R30 = 20k 1% 0603: Resistor, SMD, 20k, 0.1W, 1%, 0603

## Sheet MCISO-S08-V00-HallDifferentials.SchDoc
size A4; SheetNumber: 5; SheetTotal: 9
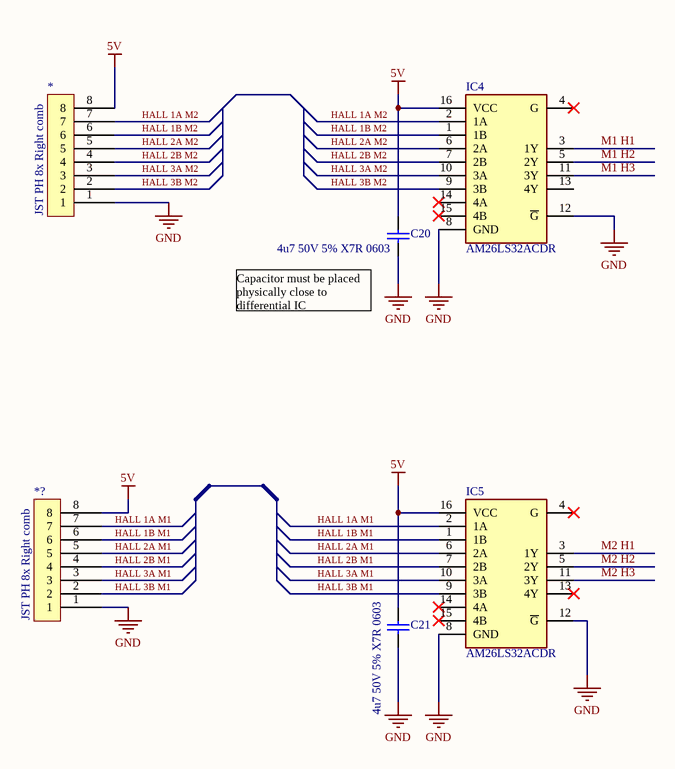
[diagram p7: MCISO-S08-V00-HallDifferentials.SchDoc]

### Parts
(Parts that share a designator on the sheet are numbered #1, #2 ... from top to bottom, then left to right.)
*#2  JST PH 8x Right comb  [JST PH 8x RIGHT SMD]
*?#2  JST PH 8x Right comb  [JST PH 8x RIGHT SMD]
C20  4u7 50V 5% X7R 0603  [Cap_Ceramic_0603]
C21  4u7 50V 5% X7R 0603  [Cap_Ceramic_0603]
IC4  AM26LS32ACDR  [SOIC127P600X175-16N]
IC5  AM26LS32ACDR  [SOIC127P600X175-16N]

### Nets
5V: *#2.8 *?#2.8 C20.2 C21.2 IC4.16(VCC) IC5.16(VCC)
GND: *#2.1 *?#2.1 C20.1 C21.1 IC4.8(GND) IC4.12(~{G}) IC5.8(GND) IC5.12(~{G})
HALL 1A M1: *?#2.7 IC5.2(1A)
HALL 1A M2: *#2.7 IC4.2(1A)
HALL 1B M1: *?#2.6 IC5.1(1B)
HALL 1B M2: *#2.6 IC4.1(1B)
HALL 2A M1: *?#2.5 IC5.6(2A)
HALL 2A M2: *#2.5 IC4.6(2A)
HALL 2B M1: *?#2.4 IC5.7(2B)
HALL 2B M2: *#2.4 IC4.7(2B)
HALL 3A M1: *?#2.3 IC5.10(3A)
HALL 3A M2: *#2.3 IC4.10(3A)
HALL 3B M1: *?#2.2 IC5.9(3B)
HALL 3B M2: *#2.2 IC4.9(3B)
M1 H1: IC4.3(1Y)
M1 H2: IC4.5(2Y)
M1 H3: IC4.11(3Y)
M2 H1: IC5.3(1Y)
M2 H2: IC5.5(2Y)
M2 H3: IC5.11(3Y)

Not connected (* = marked no-connect by the designer): IC4 4(G)* 13(4Y) 14(4A)* 15(4B)*; IC5 4(G)* 13(4Y)* 14(4A)* 15(4B)*

### Notes on the sheet
- (near C20) Capacitor must be placed physically close to differential IC

### Library data of the parts
C20 C21 = 4u7 50V 5% X7R 0603: as C14 on sheet MCISO-S04-V00-Microcontroller
IC4 IC5 = AM26LS32ACDR: Integrated Circuit; Manufacturer_Name: Texas Instruments; Datasheet Link: http://www.ti.com/lit/gpn/am26ls32ac; Height: 1.75mm; Manufacturer_Part_Number: AM26LS32ACDR; Mouser Part Number: 595-AM26LS32ACDR; Mouser Price/Stock: https://www.mouser.co.uk/ProductDetail/Texas-Instruments/AM26LS32ACDR/?qs=L4Mc90zKIpjEhSPPcfdoEw%3D%3D; Arrow Part Number: AM26LS32ACDR; Arrow Price/Stock: https://www.arrow.com/en/products/am26ls32acdr/texas-instruments

## Sheet USB-C Protection.SchDoc
size A4; SheetNumber: 9; SheetTotal: 9
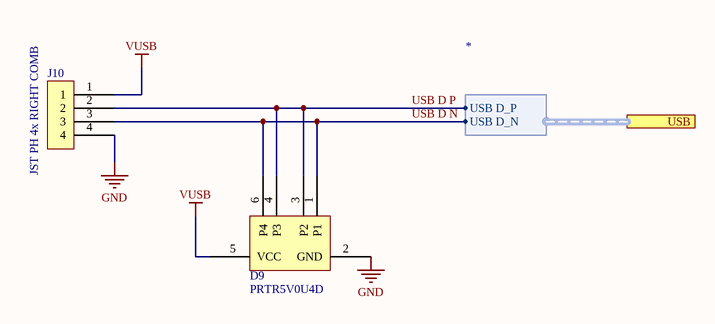
[diagram p8: USB-C Protection.SchDoc]

### Parts
D9  PRTR5V0U4D  [SC-47]
J10  JST PH 4x RIGHT COMB  [JST PH 4x RIGHT COMB]

### Ports
USB (harness *)

### Harnesses
*: USB D_P, USB D_N

### Nets
GND: D9.2(GND) J10.4
VUSB: D9.5(VCC) J10.1
USB D N: D9.1(P1) D9.6(P4) J10.3 ; port USB.USB D_N
USB D P: D9.3(P2) D9.4(P3) J10.2 ; port USB.USB D_P

### Library data of the parts
D9 = PRTR5V0U4D: Clamp Ipp Tvs Diode Surface Mount 6-TSOP

## Nets that join several sheets
3V3: MCISO-S05-V00-CANIsolation (C8.2 J1.1 U3.1), MCISO-S04-V00-Microcontroller (18 pins), MCISO-S07-V00-CANMain (C19.2 J5.1 J7.1 U8.3), VCU-S03-V00-PSU3V3 (6 pins)
5V: MCISO-S01-V00-Master (C2.2 IC1.1), VCU-S04-V00-PSU5V (5 pins), MCISO-S08-V00-HallDifferentials (6 pins)
12V: VCU-S02-V00-12VProtection (16 pins), VCU-S04-V00-PSU5V (C30.2 C31.2 U11.4 U11.5)
12VP: VCU-S02-V00-12VProtection (5 pins), VCU-S03-V00-PSU3V3 (C25.2 C26.2 U10.4 U10.5)
GND: MCISO-S01-V00-Master (6 pins), MCISO-S05-V00-CANIsolation (C8.1 U3.4), MCISO-S04-V00-Microcontroller (18 pins), MCISO-S07-V00-CANMain (C19.1 D5.3 U8.2 U8.8), VCU-S02-V00-12VProtection (20 pins), VCU-S03-V00-PSU3V3 (8 pins), VCU-S04-V00-PSU5V (8 pins), MCISO-S08-V00-HallDifferentials (8 pins), USB-C Protection (D9.2 J10.4)
CAN H: MCISO-S01-V00-Master (*1.1 *2.1), MCISO-S05-V00-CANIsolation (D3.2 J2.1 TP1.1 U4.7)
CAN L: MCISO-S01-V00-Master (*1.2 *2.2), MCISO-S05-V00-CANIsolation (D3.1 R6.1 TP4.1 U4.6)
CAN MAIN RX: MCISO-S04-V00-Microcontroller (U5.33), MCISO-S07-V00-CANMain (R13.1 TP10.1 U8.4)
CAN MAIN TX: MCISO-S04-V00-Microcontroller (U5.34), MCISO-S07-V00-CANMain (R12.1 TP8.1 U8.1)
CAN RX: MCISO-S05-V00-CANIsolation (R5.1 TP6.1 U3.3), MCISO-S04-V00-Microcontroller (U5.57)
CAN TX: MCISO-S05-V00-CANIsolation (R4.1 TP3.1 U3.2), MCISO-S04-V00-Microcontroller (U5.58)